# Altium schematic sheet FMC_AWG_DAC_PSU_LDO.SchDoc: FMC DAC 1.5GS 4CH
size 420 x 297 mm; Author: G.Kasprowicz; CompanyName: WUT ISE; DrawnBy: G.Kasprowicz; Organization: WUT ISE; Address1: PW ISE; Address2: Nowowiejska 15/19 00-665 Warsaw; Address3: gkasprow@gmail.com; DocumentNumber: 10; Revision: 1; SheetNumber: 10; SheetTotal: 12; ModifiedBy: -; CheckedDate: -; Title2: Power supply; DivGrp: WUT ISE; Designer: G.Kasprowicz; ModifiedDate: -; ProjectName: Sensor Box
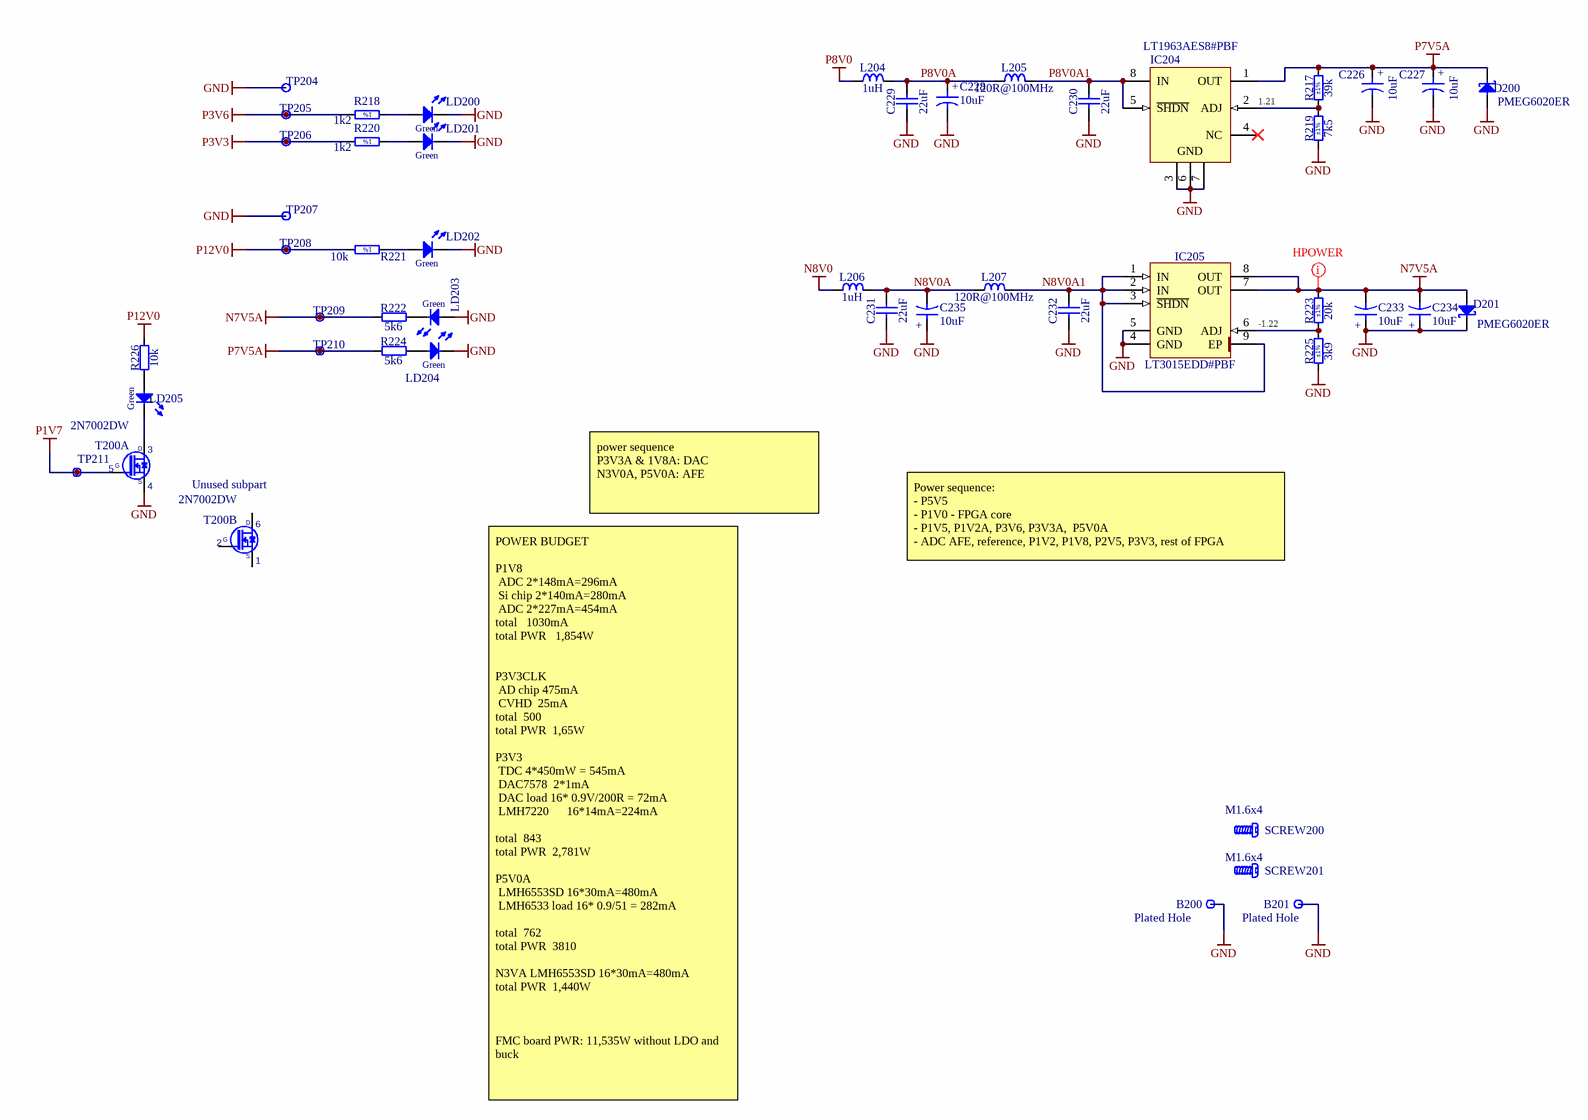
[diagram p0: FMC_AWG_DAC_PSU_LDO.SchDoc]

## Parts
B200  Plated Hole  [c300h160]  (no BOM)
B201  Plated Hole  [c300h160]  (no BOM)
C226  10uF  [CAPMP3216X180N]
C227  10uF  [CAPMP3216X180N]
C228  10uF  [CAPMP3216X180N]
C229  22uF  [CAPC2012X135N]
C230  22uF  [CAPC2012X135N]
C231  22uF  [CAPC2012X135N]
C232  22uF  [CAPC2012X135N]
C233  10uF  [CAPMP3216X180N]
C234  10uF  [CAPMP3216X180N]
C235  10uF  [CAPMP3216X180N]
D200  PMEG6020ER  [SODFL3517X110N]
D201  PMEG6020ER  [SODFL3517X110N]
IC204  LT1963AES8#PBF  [LT-S8-8_L]
IC205  LT3015EDD#PBF  [SON50P300X300X80-9N-R175X248]
L204  1uH  [INDC2620X100N]
L205  120R@100MHz  [INDC1608X65N]
L206  1uH  [INDC2620X100N]
L207  120R@100MHz  [INDC1608X65N]
LD200  Green  [LED_KINGBRIGHT_KPH-1608CGCKr]  (value not drawn)
LD201  Green  [LED_KINGBRIGHT_KPH-1608CGCKr]  (value not drawn)
LD202  Green  [LED_KINGBRIGHT_KPH-1608CGCKr]  (value not drawn)
LD203  Green  [LED_KINGBRIGHT_KPH-1608CGCK]
LD204  Green  [LED_KINGBRIGHT_KPH-1608CGCK]
LD205  Green  [LED_KINGBRIGHT_KPH-1608CGCK]
R217  39k  Tolerance: ±1%  [RESC1005X40N]
R218  1k2  [RESC1608X55N]
R219  7k5  Tolerance: ±1%  [RESC1005X40N]
R220  1k2  [RESC1608X55N]
R221  10k  [RESC1005X40N]
R222  5k6  [RESC1005X40N]
R223  20k  Tolerance: ±1%  [RESC1005X40N]
R224  5k6  [RESC1005X40N]
R225  3k9  Tolerance: ±1%  [RESC1005X40N]
R226  10k  [RESC1005X40N]
SCREW200  M1.6x4  [BOSSARD_B1.6X4/BN660_v]
SCREW201  M1.6x4  [BOSSARD_B1.6X4/BN660_v]
T200  2N7002DW  [SOT65P210X110-6N]  (parts A,B of 2)
TP204  Test Point  [TPS127]  (value not drawn)  (no BOM)
TP205  Test Point  [TPS127]  (value not drawn)  (no BOM)
TP206  Test Point  [TPS127]  (value not drawn)  (no BOM)
TP207  Test Point  [TPS127]  (value not drawn)  (no BOM)
TP208  Test Point  [TPS127]  (value not drawn)  (no BOM)
TP209  Test Point  [TPS127]  (value not drawn)  (no BOM)
TP210  Test Point  [TPS127]  (value not drawn)  (no BOM)
TP211  Test Point  [TPS127]  (value not drawn)  (no BOM)

## Nets
GND: B200.1 B201.1 C226.2 C227.2 C228.2 C229.1 C230.1 C231.1 C232.1 C233.1 C234.1 C235.1 D200.2(A) D201.1(C) IC204.3(GND) IC204.6(GND) IC204.7(GND) IC205.4(GND) IC205.5(GND) LD200.1(C) LD201.1(C) LD202.1(C) LD203.2(A) LD204.1(C) R219.1 R225.1 T200.4(S1) TP204.1 TP207.1
N7V5A: C233.2 C234.2 D201.2(A) IC205.7(OUT) IC205.8(OUT) R222.1 R223.2 TP209.1
N8V0: L206.1
P1V7: T200.5(G1) TP211.1
P3V3: R220.2 TP206.1
P3V6: R218.2 TP205.1
P7V5A: C226.1 C227.1 D200.1(C) IC204.1(OUT) R217.2 R224.1 TP210.1
P8V0: L204.1
P12V0: R221.2 R226.2 TP208.1
N8V0A: C231.2 C235.2 L206.2 L207.1
N8V0A1: C232.2 IC205.1(IN) IC205.2(IN) IC205.3(~{SHDN}) IC205.9(EP) L207.2
P8V0A: C228.1 C229.2 L204.2 L205.1
P8V0A1: C230.2 IC204.5(~{SHDN}) IC204.8(IN) L205.2
NetIC204_2: IC204.2(ADJ) R217.1 R219.2
NetIC205_6: IC205.6(ADJ) R223.1 R225.2
NetLD200_2: LD200.2(A) R218.1
NetLD201_2: LD201.2(A) R220.1
NetLD202_2: LD202.2(A) R221.1
NetLD203_1: LD203.1(C) R222.2
NetLD204_2: LD204.2(A) R224.2
NetLD205_1: LD205.1(C) T200.3(D1)
NetLD205_2: LD205.2(A) R226.1

Not connected (* = marked no-connect by the designer): IC204 4(NC)*; T200 1(S2) 2(G2) 6(D2)

## Layout directives
net class Hpower: N7V5A

## Notes on the sheet
- 1.21
- -1.22
- (near T200) Unused subpart
- power sequence
  P3V3A & 1V8A: DAC
  N3V0A, P5V0A: AFE
- Power sequence:
  - P5V5
  - P1V0 - FPGA core
  - P1V5, P1V2A, P3V6, P3V3A,  P5V0A
  - ADC AFE, reference, P1V2, P1V8, P2V5, P3V3, rest of FPGA
- POWER BUDGET
  P1V8
  ADC	2*148mA=296mA
  Si chip	2*140mA=280mA
  ADC	2*227mA=454mA
  total			1030mA
  total PWR			1,854W
  P3V3CLK
  AD chip	475mA
  CVHD 	25mA
  total		500
  total PWR		1,65W
  P3V3
  TDC	4*450mW = 545mA
  DAC7578	 2*1mA
  DAC load	16* 0.9V/200R = 72mA
  LMH7220	     16*14mA=224mA
  total		843
  total PWR		2,781W
  P5V0A
  LMH6553SD 16*30mA=480mA
  LMH6533 load 16* 0.9/51 = 282mA
  total		762
  total PWR		3810
  N3VA	LMH6553SD 16*30mA=480mA
  total PWR		1,440W
  FMC board PWR: 11,535W without LDO and buck
- Project/Equipment
- Document
- Designer
- Drawn by
- Check.by
- Copyright WUT ISE 2018.
  This documentation describes Open Hardware and is licensed under the CERN OHL v.1.1. You may redistribute and modify this documentation under the terms of the CERN OHL v.1.1. (http://ohwr.org/CERNOHL). This documentation is distributed WITHOUT ANY EXPRESS OR IMPLIED WARRANTY, INCLUDING OF MERCHANTABILITY, SATISFACTORY QUALITY AND FITNESS FOR A PARTICULAR PURPOSE. Please see the CERN OHL v.1.1 for applicable conditions.
- Contact
- File
- Last Mod.
- Print Date
- Sheet
- Size
- A3
- of
- Rev
- (in symbol 2N7002DW, part A) D; G; S
- (in symbol 2N7002DW, part B) D; G; S
- (in symbol CTE3216-18_10UF_16V_20%_AVX_TCJ) +
- (in symbol R0402_10K_1%_0.0625W_100PPM) 1%
- (in symbol R0603_1K2_1%_0.1W_100PPM) 1%

## Library data of the parts
B200 B201 = PLATED_HOLE1.6_PAD3.0: Single Terminal Socket; Part Description: Plated Through Hole: Hole Dia.=1.6mm Pad Dia.=3.0mm; Mounted: No; Part Number: PLATED_HOLE1.6_PAD3.0; Component Type: Standard (No BOM); Pin Count: 1; Family: Plated Hole; Socket: No; SMD: No; Sense: No; Status: None; ComponentHeight: 0mm; HelpURL: Undefined; Author: CERN DEM JMW; CreateDate: 05.11.2009; LatestRevisionDate: 05.11.2009; PackageDescription: Plated Through Hole: Hole Dia.=1.6mm Pad Dia.=3.0mm
C226-C228 C233-C235 = CTE3216-18_10UF_16V_20%_AVX_TCJ: Polarised capacitor; Part Description: ESR 0R200 Tantalum Solid Electrolytic Chip Capacitor with Conductive Polymer Electrode; Manufacturer: AVX; Manufacturer Part Number: TCJA106M016R0200; Voltage: 16V; Tolerance: ±20%; Part Number: CTE3216-18_10UF_16V_20%_AVX_TCJ; Component Kind: Standard; Component Type: Standard; Pin Count: 2; Value: 10uF; Status: Preferred; Case: A; Mounted: Yes; Socket: No; SMD: Yes; Sense: No; ComponentHeight: 1.8mm; HelpURL: \\cern.ch\dfs\Applications\Altium\Datasheets\CTE_AVX_TCJ.pdf; Author: CERN DEM JLC; CreateDate: 29.03.2012; LatestRevisionDate: 29.03.2012
C229-C232 = CC0805_22UF_16V_10%_X5R: Non-polarised capacitor; Part Description: SMD Multilayer Chip Ceramic Capacitor; Manufacturer: GENERIC; Manufacturer1 Part Number: C2012X5R1C226KT; Voltage: 16V; TC: X5R; Tolerance: ±10%; Part Number: CC0805_22UF_16V_10%_X5R; Component Kind: Standard; Component Type: Standard; Pin Count: 2; Value: 22uF; Status: Preferred; Manufacturer Part Number: CC0805_22UF_16V_10%_X5R; Case: 0805; Mounted: Yes; Socket: No; SMD: Yes; Sense: No; Manufacturer1 Example: TDK; Manufacturer1 ComponentHeight: 1.35mm; HelpURL: \\cern.ch\dfs\Applications\Altium\Datasheets\CC0805_X5R_TDK_C.pdf; Author: CERN DEM JLC; CreateDate: 25.10.2012; LatestRevisionDate: 25.10.2012
D200 D201 = PMEG6020ER: Schottky Diode; Part Description: MEGA Schottky Barrier Rectifier; Manufacturer: NXP SEMICONDUCTORS; Voltage: 60V; Power: 2A; PressFit: No; Bonding: No; Part Number: PMEG6020ER; Component Kind: Standard; Component Type: Standard; Device: PMEG6020ER; PackageDescription: SODFL Diode (SOD123W); 2.60mm W X 1.70mm L X 1.10mm H body, IPC Medium Density; Manufacturer Part Number: PMEG6020ER; Pin Count: 2; Case: SOD123; Mounted: Yes; Socket: No; SMD: Yes; Sense: No; ComponentHeight: 0.65mm; HelpURL: \\cern.ch\dfs\Applications\Altium\Datasheets\PMEG6020ER.pdf; Author: CERN DEM JMW; CreateDate: 19.06.2014; LatestRevisionDate: 19.06.2014
IC204 = CMP-0476-01595-1: 1.5 A, Low Noise, Fast Transient Response LDO Regulator, 2.1 to 20 V Vin, Adjustable Vout, 8-pin SOIC (S8-8), -40 to 125 degC, Pb-Free; Manufacturer: Linear Technology; Isupply(mA): 1; Shutdown Current(uA): 0.01; PSRR(dB): 63; Vin Min(V): 2.1; Vout Max(V): 20; Vout Min(V): 1.21; Iout(mA): 1500; Noise(uV): 40; Output Voltage: Adj; Dropout Voltage(V): 0.34; Discrete Pass Element: no; PackageVersion: Rev. G, 03/2012; Mounting Technology: Surface Mount; Number of Outputs: 1; RoHS: TRUE; ComponentLink1URL: http://www.linear.com/; PackageReference: S8-8; Vin Max(V): 20; ComponentLink2URL: http://cds.linear.com/docs/en/datasheet/1963afe.pdf; PackageDescription: 8-Pin Plastic Small Outline (Narrow .150 Inch), Body 4.9 x 3.9 mm, Pitch 1.27 mm; ComponentLink1Description: Manufacturer URL; ComponentLink2Description: Datasheet; ComponentLink3URL: http://cds.linear.com/docs/en/packaging/05081610_G_SO8.pdf; ComponentLink3Description: Package Specification; PartNumber: LT1963AES8#PBF; DatasheetVersion: Rev. E
IC205 = LT3015EDD#PBF: 1.5A, Low Noise, Negative Linear Regulator with Precision Current Limit; Part Description: –1.22V to –29.3V, 1.5A, Low Noise, Negative Linear Regulator with Precision Current Limit; Manufacturer: LINEAR TECHNOLOGY; PressFit: No; Bonding: No; Part Number: LT3015EDD#PBF; Component Kind: Standard; Component Type: Standard; Device: LT3015EDD#PBF; PackageDescription: SON, (DFN) 0.50mm,pitch; 8 pin,3.00mm W X 3.00mm L X 0.80mm H body (w/thermal tab 1.75 X2.48mm), IPC Medium Density; Manufacturer Part Number: LT3015EDD#PBF; Pin Count: 9; Case: SON8; Mounted: Yes; Socket: No; SMD: Yes; Sense: No; ComponentHeight: 0.8mm; HelpURL: \\cern.ch\dfs\Applications\Altium\Datasheets\LT3015EDD#PBF.pdf; Author: CERN DEM MR; CreateDate: 10.02.2016; LatestRevisionDate: 10.02.2016
L204 L206 = IND1008_1UH_20%_WURTH_74479787210B: Inductor; Part Description: Power Multilayer Inductor (WE-PMI Series); Manufacturer: WURTH ELEKTRONIK; Power: 1.95A; Resistance: 0.06R; Tolerance: ±20%; Part Number: IND1008_1UH_20%_WURTH_74479787210B; Component Kind: Standard; Component Type: Standard; Pin Count: 2; Value: 1uH; Status: None; Manufacturer Part Number: 74479787210B; Mounted: Yes; Socket: No; SMD: Yes; Sense: No; ComponentHeight: 1mm; HelpURL: \\cern.ch\dfs\Applications\Altium\Datasheets\IND_WURTH_WE-PMI_74479787210B.pdf; Author: CERN DEM JLC; CreateDate: 01.10.2014; LatestRevisionDate: 01.10.2014; Case: 1008
L205 L207 = IND0603_MURATA_BLM18SG121TN1D: Inductor; Part Description: SMD EMIFIL Suppression Chip Ferrite Bead; Manufacturer: MURATA; Power: 3A; Resistance: 0.025R; Tolerance: ±25%; Part Number: IND0603_MURATA_BLM18SG121TN1D; Component Kind: Standard; Component Type: Standard; Pin Count: 2; Value: 120R@100MHz; Status: None; Manufacturer Part Number: BLM18SG121TN1D; Case: 0603; Mounted: Yes; Socket: No; SMD: Yes; Sense: No; ComponentHeight: 0.65mm; HelpURL: \\cern.ch\dfs\Applications\Altium\Datasheets\IND0603_MURATA_BLM18S.pdf; Author: CERN DEM JLC; CreateDate: 23.07.2014; LatestRevisionDate: 23.07.2014
LD200-LD202 = LED_0603_Green: Green 0603; Part Number: LED_KINGBRIGHT_KPH-1608CGCK; Part Description: SMD Green LED, Case 1.6mmX0.8mm(0603), 0.65mm Thickness; Manufacturer: KINGBRIGHT; Manufacturer Part Number: KPH-1608CGCK; PressFit: No; Bonding: No; Component Kind: Standard; Component Type: Standard; Color: Green; Footprint: LED_KINGBRIGHT_KPH-1608CGCK; PackageDescription: SMT Green LED, Case 0603, Body L 1.6 x W 0.8mm H 0.65mm; Pin Count: 2; Mounted: Yes; Socket: No; SMD: Yes; Sense: No; ComponentHeight: 0.65mm; HelpURL: \\cern.ch\dfs\Applications\Altium\Datasheets\LED_KINGBRIGHT_KPH-1608CGCK.pdf; Author: CERN DEM JLC; CreateDate: 03.07.2017; LatestRevisionDate: 03.07.2017
LD203-LD205 = LED_KINGBRIGHT_KPH-1608CGCK: LED Green 1C 2A; Part Description: SMD Green LED, Case 1.6mmX0.8mm(0603), 0.65mm Thickness; PressFit: No; Bonding: No; Part Number: LED_KINGBRIGHT_KPH-1608CGCK; Component Kind: Standard; Component Type: Standard; Color: Green; PackageDescription: SMT Green LED, Case 0603, Body L 1.6 x W 0.8mm H 0.65mm; Manufacturer: KINGBRIGHT; Manufacturer Part Number: KPH-1608CGCK; Pin Count: 2; Mounted: Yes; Socket: No; SMD: Yes; Sense: No; ComponentHeight: 0.65mm; HelpURL: \\cern.ch\dfs\Applications\Altium\Datasheets\LED_KINGBRIGHT_KPH-1608CGCK.pdf; Author: CERN DEM JLC; CreateDate: 03.07.2017; LatestRevisionDate: 03.07.2017
R217 = R0402_39K_1%_0.0625W_100PPM: Resistor - 1%; Part Description: General Purpose Thick Film Chip Resistor; Manufacturer: GENERIC; Manufacturer1 Part Number: 232270673903; TC: ±100ppm/°C; PressFit: No; Part Number: R0402_39K_1%_0.0625W_100PPM; Component Kind: Standard; Component Type: Standard; Pin Count: 2; Value: 39k; Status: Not Recommended; Power: 0.0625W; Manufacturer Part Number: R0402_39K_1%_0.0625W_100PPM; Case: 0402; Mounted: Yes; Sense: No; Socket: No; SMD: Yes; Manufacturer1 Example: YAGEO PHYCOMP; Manufacturer1 ComponentHeight: 0.4mm; HelpURL: \\cern.ch\dfs\Applications\Altium\Datasheets\R0402_Phycomp_RC0402.pdf; Author: CERN DEM JLC; CreateDate: 03.12.2007; LatestRevisionDate: 17.10.2012
R218 R220 = R0603_1K2_1%_0.1W_100PPM: Resistor - 1%; Part Description: General Purpose Thick Film Chip Resistor; Manufacturer: GENERIC; Manufacturer1 Part Number: NRC06F1201TRF; Power: 0.1W; TC: ±100ppm/°C; Part Number: R0603_1K2_1%_0.1W_100PPM; Component Kind: Standard; Component Type: Standard; Pin Count: 2; Value: 1k2; Status: Preferred; Tolerance: ±1%; Manufacturer Part Number: R0603_1K2_1%_0.1W_100PPM; Case: 0603; Mounted: Yes; Sense: No; Socket: No; SMD: Yes; Manufacturer1 Example: NIC COMPONENT; Manufacturer1 ComponentHeight: 0.55mm; HelpURL: \\cern.ch\dfs\Applications\Altium\Datasheets\R0603_NIC_NRC.pdf; Author: CERN DEM JLC; CreateDate: 03.12.2007; LatestRevisionDate: 13.03.2008
R219 = R0402_7K5_1%_0.0625W_100PPM: Resistor - 1%; Part Description: General Purpose Thick Film Chip Resistor; Manufacturer: GENERIC; Manufacturer1 Part Number: 232270677502L; TC: ±100ppm/°C; PressFit: No; Part Number: R0402_7K5_1%_0.0625W_100PPM; Component Kind: Standard; Component Type: Standard; Pin Count: 2; Value: 7k5; Status: Not Recommended; Power: 0.0625W; Manufacturer Part Number: R0402_7K5_1%_0.0625W_100PPM; Case: 0402; Mounted: Yes; Sense: No; Socket: No; SMD: Yes; Manufacturer1 Example: YAGEO PHYCOMP; Manufacturer1 ComponentHeight: 0.4mm; HelpURL: \\cern.ch\dfs\Applications\Altium\Datasheets\R0402_Phycomp_RC0402.pdf; Author: CERN DEM JLC; CreateDate: 03.12.2007; LatestRevisionDate: 17.10.2012
R221 = R0402_10K_1%_0.0625W_100PPM: Resistor - 1%; Part Description: General Purpose Thick Film Chip Resistor; Manufacturer: GENERIC; Manufacturer1 Part Number: 232270671003L; TC: ±100ppm/°C; Part Number: R0402_10K_1%_0.0625W_100PPM; Component Kind: Standard; Component Type: Standard; Pin Count: 2; Value: 10k; Status: Not recommended; Power: 0.0625W; Tolerance: ±1%; Manufacturer Part Number: R0402_10K_1%_0.0625W_100PPM; Case: 0402; Mounted: Yes; Sense: No; Socket: No; SMD: Yes; Manufacturer1 Example: YAGEO PHYCOMP; Manufacturer1 ComponentHeight: 0.4mm; HelpURL: \\cern.ch\dfs\Applications\Altium\Datasheets\R0402_Phycomp_RC0402.pdf; Author: CERN DEM JLC; CreateDate: 03.12.2007; LatestRevisionDate: 17.10.2012
R222 R224 = R0402_5k6_1%_0.0625W_100PPM: Resistor - 1%; Part Description: General Purpose Thick Film Chip Resistor; Manufacturer: GENERIC; Manufacturer1 Part Number: 232270675602L; TC: ±100ppm/°C; PressFit: No; Part Number: R0402_5K6_1%_0.0625W_100PPM; Component Kind: Standard; Component Type: Standard; Pin Count: 2; Value: 5k6; Status: Not Recommended; Power: 0.0625W; Tolerance: ±1%; Manufacturer Part Number: R0402_5K6_1%_0.0625W_100PPM; Case: 0402; Mounted: Yes; Sense: No; Socket: No; SMD: Yes; Manufacturer1 Example: YAGEO PHYCOMP; Manufacturer1 ComponentHeight: 0.4mm; HelpURL: \\cern.ch\dfs\Applications\Altium\Datasheets\R0402_Phycomp_RC0402.pdf; Author: CERN DEM JLC; CreateDate: 03.12.2007; LatestRevisionDate: 17.10.2012
R223 = R0402_20K_1%_0.0625W_100PPM: Resistor - 1%; Part Description: General Purpose Thick Film Chip Resistor; Manufacturer: GENERIC; Manufacturer1 Part Number: 232270672003L; TC: ±100ppm/°C; PressFit: No; Part Number: R0402_20K_1%_0.0625W_100PPM; Component Kind: Standard; Component Type: Standard; Pin Count: 2; Value: 20k; Status: Not Recommended; Power: 0.0625W; Manufacturer Part Number: R0402_20K_1%_0.0625W_100PPM; Case: 0402; Mounted: Yes; Sense: No; Socket: No; SMD: Yes; Manufacturer1 Example: YAGEO PHYCOMP; Manufacturer1 ComponentHeight: 0.4mm; HelpURL: \\cern.ch\dfs\Applications\Altium\Datasheets\R0402_Phycomp_RC0402.pdf; Author: CERN DEM JLC; CreateDate: 03.12.2007; LatestRevisionDate: 17.10.2012
R225 = R0402_3K9_1%_0.0625W_100PPM: Resistor - 1%; Part Description: General Purpose Thick Film Chip Resistor; Manufacturer: GENERIC; Manufacturer1 Part Number: 232270673902L; TC: ±100ppm/°C; PressFit: No; Part Number: R0402_3K9_1%_0.0625W_100PPM; Component Kind: Standard; Component Type: Standard; Pin Count: 2; Value: 3k9; Status: Not Recommended; Power: 0.0625W; Manufacturer Part Number: R0402_3K9_1%_0.0625W_100PPM; Case: 0402; Mounted: Yes; Sense: No; Socket: No; SMD: Yes; Manufacturer1 Example: YAGEO PHYCOMP; Manufacturer1 ComponentHeight: 0.4mm; HelpURL: \\cern.ch\dfs\Applications\Altium\Datasheets\R0402_Phycomp_RC0402.pdf; Author: CERN DEM JLC; CreateDate: 03.12.2007; LatestRevisionDate: 17.10.2012
R226 = R0402_10K_1%_0.0625W_100PPM: Resistor - 1%; Part Description: General Purpose Thick Film Chip Resistor; Manufacturer: GENERIC; Manufacturer1 Part Number: 232270671003L; TC: ±100ppm/°C; PressFit: No; Part Number: R0402_10K_1%_0.0625W_100PPM; Component Kind: Standard; Component Type: Standard; Pin Count: 2; Value: 10k; Status: Not Recommended; Power: 0.0625W; Tolerance: ±1%; Manufacturer Part Number: R0402_10K_1%_0.0625W_100PPM; Case: 0402; Mounted: Yes; Sense: No; Socket: No; SMD: Yes; Manufacturer1 Example: YAGEO PHYCOMP; Manufacturer1 ComponentHeight: 0.4mm; HelpURL: \\cern.ch\dfs\Applications\Altium\Datasheets\R0402_Phycomp_RC0402.pdf; Author: CERN DEM JLC; CreateDate: 03.12.2007; LatestRevisionDate: 17.10.2012
SCREW200 SCREW201 = MECH_SCREW_M1.6x4: Screw; Part Number: BOSSARD_B1.6X4/BN660; Part Description: M1.6 L=4mm Philips Head Machine Screw, DIN 7985A, Stainless Steel A2; Manufacturer: BOSSARD; Manufacturer Part Number: B1.6X4/BN660; PressFit: No; Component Kind: Standard; Component Type: Mechanical; Pin Count: 0; PackageDescription: M1.6 L=4mm Philips Head Machine Screw, DIN 7985A, Stainless Steel A2; Mounted: Yes; Socket: No; SMD: No; Sense: No; Status: None; Value: M1.6x4; ComponentHeight: 1mm; HelpURL: \\cern.ch\dfs\Applications\Altium\Datasheets\BOSSARD_BN650-1243721.pdf; Author: GK; CreateDate: 04.12.2015; LatestRevisionDate: 04.12.2015
T200 = 2N7002DW: 60 V, 115 mA, Dual N-Channel Field Effect Transistor, Enhancement Mode; Part Description: 60V 115mA Dual N-Channel Field Effect Transistor, Enhancement Mode; Manufacturer: ON SEMICONDUCTOR; PressFit: No; Bonding: No; Part Number: 2N7002DW; Component Kind: Standard; Component Type: Standard; Device: 2N7002DW; PackageDescription: SOT363, SC70-6, 0.65mm Pitch; 6 Pin, 1.25mm W X 2.00mm L X 1.10mm H body, IPC Medium Density; Manufacturer Part Number: 2N7002DW; Pin Count: 6; Case: SOT363; Mounted: Yes; Socket: No; SMD: Yes; Sense: No; ComponentHeight: 1.1mm; HelpURL: \\cern.ch\dfs\Applications\Altium\Datasheets\2N7002DW.pdf; Author: CERN DEM BC; CreateDate: 25.11.2020; LatestRevisionDate: 25.11.2020
TP204-TP211 = SMD_PAD_1.27X1.27MM: Part Description: 1.27mm x 1.27mm PCB Copper Area (SMD Test Point); Mounted: No; Part Number: SMD_PAD_1.27X1.27MM; Component Type: Standard (No BOM); Pin Count: 1; Family: Test Point; Socket: No; SMD: Yes; Sense: No; Status: None; ComponentHeight: 0mm; HelpURL: Undefined; Author: CERN DEM JLC; CreateDate: 12.01.2008; LatestRevisionDate: 12.01.2008; PackageDescription: 1.27mm x 1.27mm PCB Copper Area (SMD Test Point)